# EAGLE board EEZ Arduino shield+BP r1B13 (EAGLE 6.1), part 1 of 2
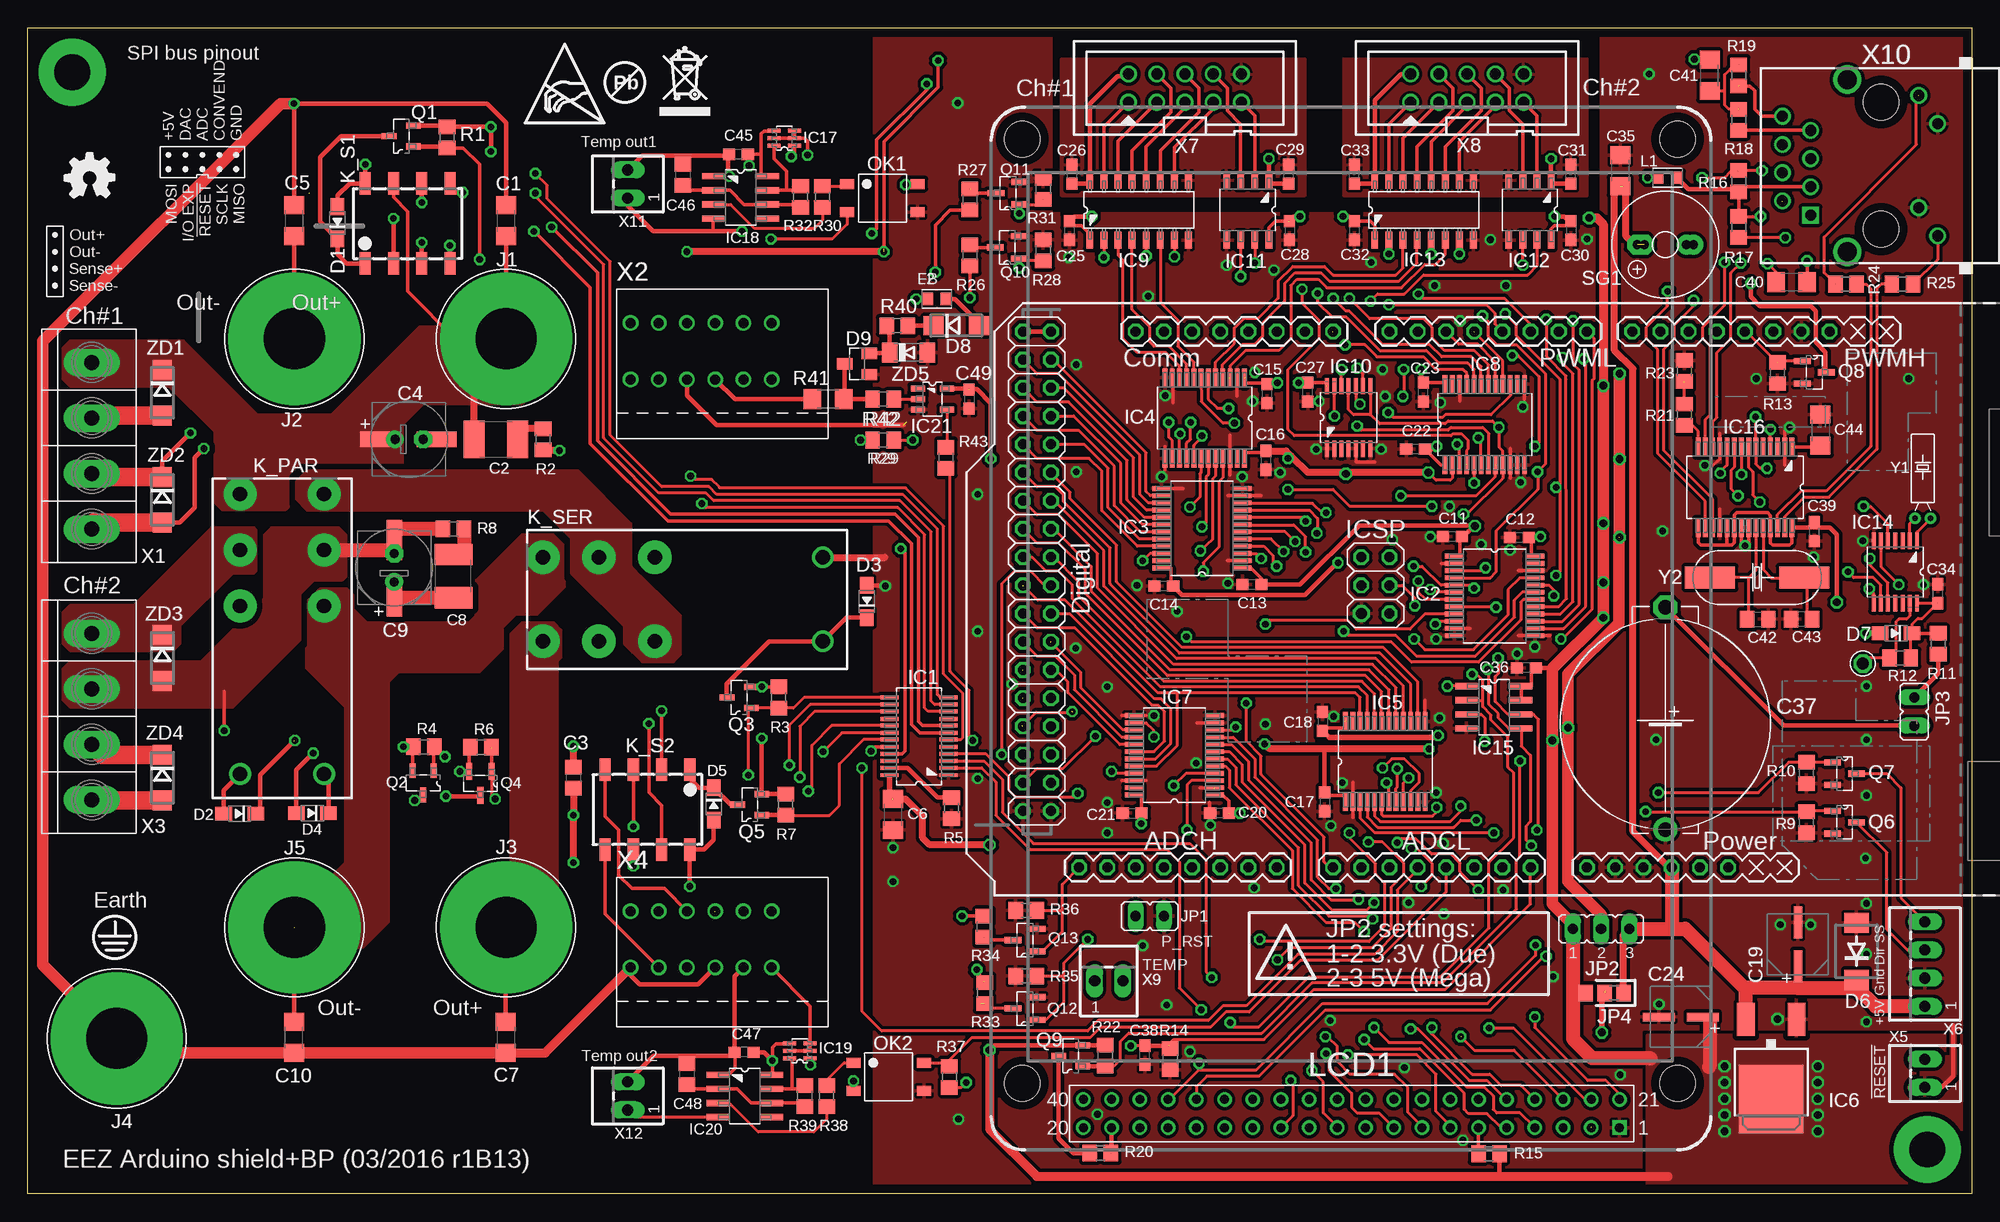
[diagram p5: board, top side]
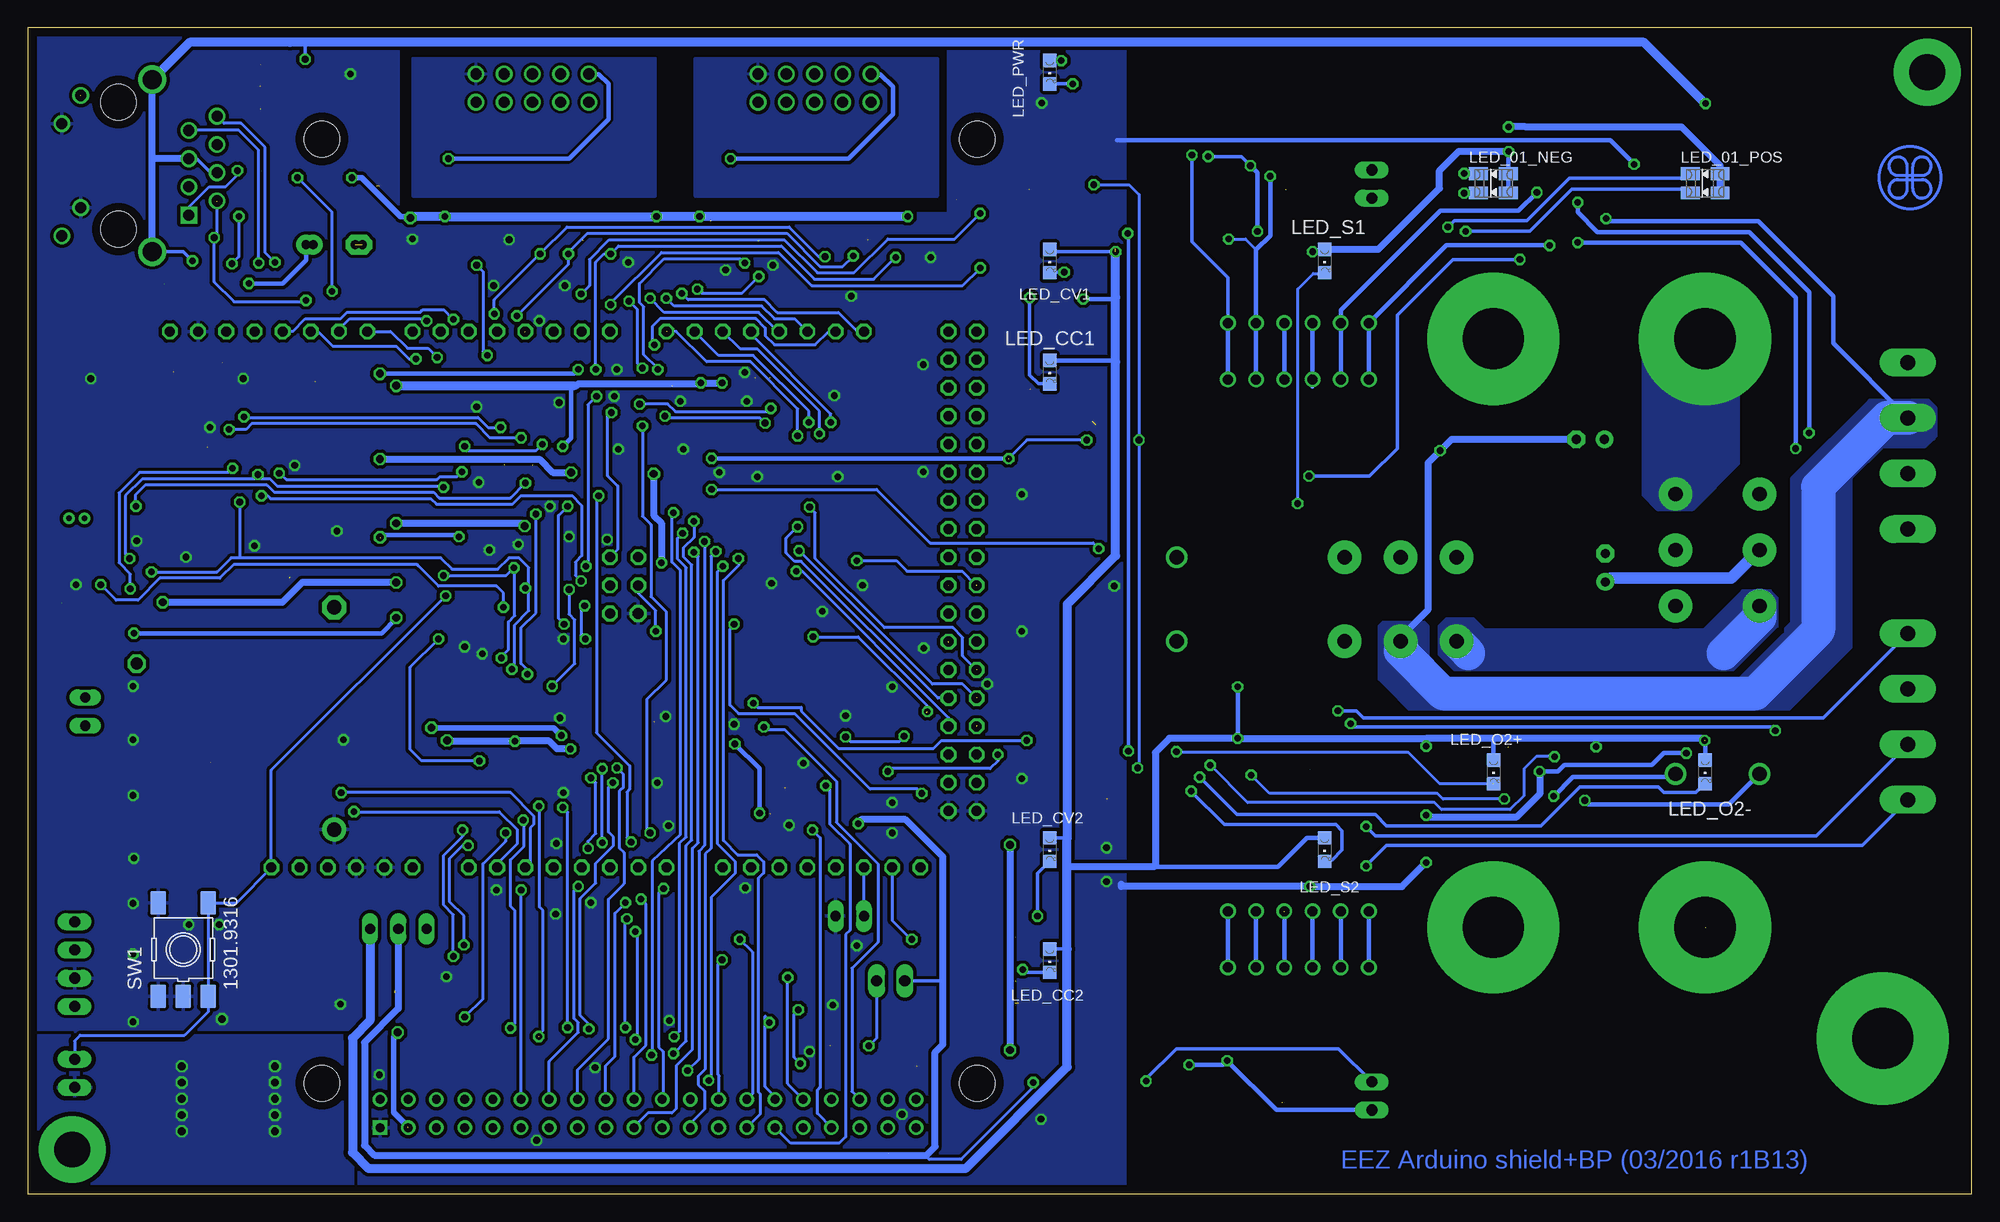
[diagram p6: board, bottom side, seen from below]

Size 175 x 105 mm. Coordinates in mm from the lower left corner, seen from the top.
Outline: 0,0 0,105 175,105 175,0 0,0
Copper layers (1+5*16): Top 0.035mm / dielectric 0.75mm / Route5 0.035mm / dielectric 0.75mm / Bottom 0.035mm
Design rules: minimum track width 10mil, minimum drill 0.5mm, track to track 8mil, track to pad 8mil, pad to pad 8mil, via to via 8mil, smd to smd 8mil, copper to edge 30mil, drill to drill 8mil, minimum pad ring 10mil, minimum via ring 8mil, stop-mask expansion 0mil, vias tented up to drill 25mil, thermal gap 10mil
Net classes: 0 default: width 0.254 mm, drill 0.584 mm, clearance 0.254 mm; 1 power: width 0.254 mm, drill 0.584 mm, clearance 0.203 mm; 2 gnd: width 0.254 mm, drill 0.584 mm, clearance 0.203 mm; 3 isolators: width 0.254 mm, drill 0.584 mm, clearance 0.254 mm

## Footprints (pad centres in the part's own frame; a part is rotated, then mirrored left to right if it is on the bottom)
C1206 = smd 1.6 x 1.8: 1 -1.4,0; 2 1.4,0
C1812 = smd 1.9 x 3.4: 1 -1.95,0; 2 1.95,0
C0805 = smd 1.3 x 1.5: 1 -0.95,0; 2 0.95,0
CAPAE660X610N_COMBO2 = smd 3.6 x 1.4: 1 -2.6,0; 2 2.5,0 | drill 0.813 pad 1.6: 1.1 -1.27,0 | drill 0.813 pad 1.6 octagon: 2.1 1.27,0
C0603 = smd 1.1 x 1: 1 -0.85,0; 2 0.85,0
PANASONIC_C = smd 2.87 x 0.762: 1 -1.981,0; 2 1.981,0
SG-R20MM = drill 1.3 pad 2.184 octagon: 1 10.389,0 | drill 1.3 pad 2.184: 2 -9.601,0
SOD323-W = smd 1.5 x 1.2: A 1.45,0; C -1.45,0
DO214AA = smd 1.8 x 2.2: A 2.55,0; C -2.55,0
DO214AC = smd 1.8 x 1.7: A 2.05,0; C -2.05,0
SOT23 = smd 1 x 1.4: 1 -0.95,-1.1; 2 0.95,-1.1; 3 0,1.1
SOP63P600X175-24N = smd 1.6 x 0.356: 1 -2.667,3.505; 2 -2.667,2.845; 3 -2.667,2.235; 4 -2.667,1.575; 5 -2.667,0.965; 6 -2.667,0.305; 7 -2.667,-0.305; 8 -2.667,-0.965; 9 -2.667,-1.575; 10 -2.667,-2.235; 11 -2.667,-2.845; 12 -2.667,-3.505; 13 2.667,-3.505; 14 2.667,-2.845; 15 2.667,-2.235; 16 2.667,-1.575; 17 2.667,-0.965; 18 2.667,-0.305; 19 2.667,0.305; 20 2.667,0.965; 21 2.667,1.575; 22 2.667,2.235; 23 2.667,2.845; 24 2.667,3.505
SOP65P780X200-24N = smd 1.651 x 0.432: 1 -3.632,3.581; 2 -3.632,2.921; 3 -3.632,2.286; 4 -3.632,1.626; 5 -3.632,0.965; 6 -3.632,0.33; 7 -3.632,-0.33; 8 -3.632,-0.965; 9 -3.632,-1.626; 10 -3.632,-2.286; 11 -3.632,-2.921; 12 -3.632,-3.581; 13 3.632,-3.581; 14 3.632,-2.921; 15 3.632,-2.286; 16 3.632,-1.626; 17 3.632,-0.965; 18 3.632,-0.33; 19 3.632,0.33; 20 3.632,0.965; 21 3.632,1.626; 22 3.632,2.286; 23 3.632,2.921; 24 3.632,3.581
DPACK = smd 1.6 x 3: 1 -2.28,-4.8; 3 2.28,-4.8 | smd 5.8 x 6.2: 4 0,2.38
SOIC-16 = smd 1.549 x 0.61: 1 -2.692,4.445; 2 -2.692,3.175; 3 -2.692,1.905; 4 -2.692,0.635; 5 -2.692,-0.635; 6 -2.692,-1.905; 7 -2.692,-3.175; 8 -2.692,-4.445; 9 2.692,-4.445; 10 2.692,-3.175; 11 2.692,-1.905; 12 2.692,-0.635; 13 2.692,0.635; 14 2.692,1.905; 15 2.692,3.175; 16 2.692,4.445
SOP65P640X120-14N = smd 1.473 x 0.356: 1 -2.819,1.956; 2 -2.819,1.295; 3 -2.819,0.66; 4 -2.819,0; 5 -2.819,-0.66; 6 -2.819,-1.295; 7 -2.819,-1.956; 8 2.819,-1.956; 9 2.819,-1.295; 10 2.819,-0.66; 11 2.819,0; 12 2.819,0.66; 13 2.819,1.295; 14 2.819,1.956
SOIC127P600X173-8N = smd 1.55 x 0.6: 1 -2.7,1.9; 2 -2.7,0.63; 3 -2.7,-0.64; 4 -2.7,-1.91; 5 2.7,-1.91; 6 2.7,-0.64; 7 2.7,0.63; 8 2.7,1.9
SOIC127P600X175-8N = smd 1.981 x 0.559: 1 -2.464,1.905; 2 -2.464,0.635; 3 -2.464,-0.635; 4 -2.464,-1.905; 5 2.464,-1.905; 6 2.464,-0.635; 7 2.464,0.635; 8 2.464,1.905
SOP65P780X200-28N = smd 1.651 x 0.432: 1 -3.632,4.216; 2 -3.632,3.581; 3 -3.632,2.921; 4 -3.632,2.286; 5 -3.632,1.626; 6 -3.632,0.965; 7 -3.632,0.33; 8 -3.632,-0.33; 9 -3.632,-0.965; 10 -3.632,-1.626; 11 -3.632,-2.286; 12 -3.632,-2.921; 13 -3.632,-3.581; 14 -3.632,-4.216; 15 3.632,-4.216; 16 3.632,-3.581; 17 3.632,-2.921; 18 3.632,-2.286; 19 3.632,-1.626; 20 3.632,-0.965; 21 3.632,-0.33; 22 3.632,0.33; 23 3.632,0.965; 24 3.632,1.626; 25 3.632,2.286; 26 3.632,2.921; 27 3.632,3.581; 28 3.632,4.216
SOT65P210X110-6N = smd 1.168 x 0.356: 1 -0.94,0.66; 2 -0.94,0; 3 -0.94,-0.66; 4 0.94,-0.66; 5 0.94,0; 6 0.94,0.66
SOT95P280X145-5N = smd 1.27 x 0.559: 1 -1.295,0.94; 2 -1.295,0; 3 -1.295,-0.94; 4 1.295,-0.94; 5 1.295,0.94
BP_5_12 = drill 5.5 pad 11.9: P$1 0,0
JP1 = drill 0.914 long: 1 0,-1.27; 2 0,1.27
JUMPER_3-PIN = drill 0.914 long: 1 -2.54,0; 2 0,0; 3 2.54,0
A0R-JMP = smd 1.5 x 1.3: 1 0,1.7; 2 0,0; 3 0,-1.7
RT-C/016A5_ROUND = drill 1.3 pad 3: 11A 8.83,3.78; 11B 8.83,-3.78; 12A 3.79,3.78; 12B 3.79,-3.78; 14A 13.87,3.78; 14B 13.87,-3.78 | drill 1.3: A1 -11.33,-3.78; A2 -11.33,3.78
G6K-2F = smd 1 x 2: 1 -3.81,-3.6; 2 -1.27,-3.6; 3 1.27,-3.6; 4 3.81,-3.6; 5 3.81,3.6; 6 1.27,3.6; 7 -1.27,3.6; 8 -3.81,3.6
BEAD0603 = smd 1 x 1.1: P$1 -0.85,0; P$2 0.85,0
LCD_TFT_320QVT_MIRROR = drill 0.8 square: 1 48.26,0 | drill 0.8: 2 45.72,0; 3 43.18,0; 4 40.64,0; 5 38.1,0; 6 35.56,0; 7 33.02,0; 8 30.48,0; 9 27.94,0; 10 25.4,0; 11 22.86,0; 12 20.32,0; 13 17.78,0; 14 15.24,0; 15 12.7,0; 16 10.16,0; 17 7.62,0; 18 5.08,0; 19 2.54,0; 20 0,0; 21 48.26,2.54; 22 45.72,2.54; 23 43.18,2.54; 24 40.64,2.54; 25 38.1,2.54; 26 35.56,2.54; 27 33.02,2.54; 28 30.48,2.54; 29 27.94,2.54; 30 25.4,2.54; 31 22.86,2.54; 32 20.32,2.54; 33 17.78,2.54; 34 15.24,2.54; 35 12.7,2.54; 36 10.16,2.54; 37 7.62,2.54; 38 5.08,2.54; 39 2.54,2.54; 40 0,2.54 | hole 3.2: -5.5,4; 53.5,4; -5.5,89; 53.5,89
LED_KPB-3025 = smd 1.7 x 1.15: 1 1.35,0.875; 2 -1.35,0.875; 3 1.35,-0.875; 4 -1.35,-0.875
CHIPLED_0805 = smd 1.2 x 1.2: A 0,-1.05; C 0,1.05
ARDUINO+ICSP_MIRROR = drill 0.9 octagon: 0 63.5,2.54; 1 60.96,2.54; 2 58.42,2.54; 3 55.88,2.54; 3.3V 35.56,50.8; 4 53.34,2.54; 5 50.8,2.54; 5V 38.1,50.8; 5V(1) 93.98,2.54; 5V(2) 96.52,2.54; 6 48.26,2.54; 7 45.72,2.54; 8 41.656,2.54; 9 39.116,2.54; 10 36.576,2.54; 11 34.036,2.54; 12 31.496,2.54; 13 28.956,2.54; 14 68.58,2.54; 15 71.12,2.54; 16 73.66,2.54; 17 76.2,2.54; 18 78.74,2.54; 19 81.28,2.54; 20 83.82,2.54; 21 86.36,2.54; 22 93.98,5.08; 23 96.52,5.08; 24 93.98,7.62; 25 96.52,7.62; 26 93.98,10.16; 27 96.52,10.16; 28 93.98,12.7; 29 96.52,12.7; 30 93.98,15.24; 31 96.52,15.24; 32 93.98,17.78; 33 96.52,17.78; 34 93.98,20.32; 35 96.52,20.32; 36 93.98,22.86; 37 96.52,22.86; 38 93.98,25.4; 39 96.52,25.4; 40 93.98,27.94; 41 96.52,27.94; 42 93.98,30.48; 43 96.52,30.48; 44 93.98,33.02; 45 96.52,33.02; 46 93.98,35.56; 47 96.52,35.56; 48 93.98,38.1; 49 96.52,38.1; 50 93.98,40.64; 51 96.52,40.64; 52 93.98,43.18; 53 96.52,43.18; A0 50.8,50.8; A1 53.34,50.8; A2 55.88,50.8; A3 58.42,50.8; A4 60.96,50.8; A5 63.5,50.8; A6 66.04,50.8; A7 68.58,50.8; A8 73.66,50.8; A9 76.2,50.8; A10 78.74,50.8; A11 81.28,50.8; A12 83.82,50.8; A13 86.36,50.8; A14 88.9,50.8; A15 91.44,50.8; AREF 23.876,2.54; GND 26.416,2.54; GND1 40.64,50.8; GND2 43.18,50.8; GND3 93.98,45.72; GND4 96.52,45.72; ICSP_+5V 66.04,22.86; ICSP_MISO 63.5,22.86; ICSP_MOSI 66.04,25.4; ICSP_RESET 63.5,27.94; ICSP_SCK 63.5,25.4; RESET 33.02,50.8; VIN 45.72,50.8 | drill 1.016 octagon: ICSP_GND 66.04,27.94
HCPL-181 = smd 0.889 x 1.27: 1 -1.27,-3.175; 2 1.27,-3.175; 3 1.27,3.175; 4 -1.27,3.175
SOT95P237X112-3N = smd 1.321 x 0.559: 1 -1.092,0.94; 2 -1.092,-0.94; 3 1.092,0
SOT103P240X110-3N = smd 1.524 x 0.559: 1 -1.079,1.016; 2 -1.079,-1.016; 3 1.079,0
R0805 = smd 1.3 x 1.5: 1 -0.95,0; 2 0.95,0
R1206 = smd 1.6 x 1.803: 1 -1.422,0; 2 1.422,0
BUZZER = drill 0.8 pad 1.778 octagon: + 1.905,0; +B 2.54,0 | drill 0.8 pad 1.778: - -1.905,0; -B -2.54,0
TACTM-6XN = smd 2.1 x 1.4: 1 -4.2,2.25; 2 4.2,2.25; 3 -4.2,-2.25; 4 4.2,-2.25; 5 -4.2,0
PCB_SHIELD_TAB = drill 1.1 octagon: 1 0,0
TBLOCK5.0_4 = drill 1.35 pad 2.54 long: P$1 0,0; P$2 0,-5; P$3 0,-10; P$4 0,-15
MC000005_MIRROR = drill 0.9: 1 0,0; 1.1 0,-5.08; 2 -2.54,0; 2.1 -2.54,-5.08; 3 -5.08,0; 3.1 -5.08,-5.08; 4 -7.62,0; 4.1 -7.62,-5.08; 5 -10.16,0; 5.1 -10.16,-5.08; 6 -12.7,0; 6.1 -12.7,-5.08
22-23-2021 = drill 1 long: 1 -1.27,0; 2 1.27,0
22-23-2041 = drill 1 long: 1 -3.81,0; 2 -1.27,0; 3 1.27,0; 4 3.81,0
IDC-10PIN = drill 1 pad 1.422: 1 -5.08,-1.27; 2 -5.08,1.27; 3 -2.54,-1.27; 4 -2.54,1.27; 5 0,-1.27; 6 0,1.27; 7 2.54,-1.27; 8 2.54,1.27; 9 5.08,-1.27; 10 5.08,1.27
RJ45-TRAFO-LED = drill 1 square: 1 -4.445,6.35 | drill 1: 2 -3.175,8.89; 3 -1.905,6.35; 4 -0.635,8.89; 5 0.635,6.35; 6 1.905,8.89; 7 3.175,6.35; 8 4.445,8.89; 9 -6.325,-5.08; 10 -3.785,-3.38; 11 3.785,-5.08; 12 6.325,-3.38 | drill 1.7: SH1 -7.75,3.05; SH2 7.75,3.05 | hole 3.2: -5.715,0; 5.715,0
R26_XTAL = drill 0.5: 1 -0.7,0; 2 0.7,0
HC-49/4H = smd 4.5 x 2: 1 -4.25,0; 2 4.25,0
MINIMELF = smd 1.4 x 1.8: A 1.7,0; C -1.7,0

## Placement (x,y rotation side)
C1  10n  [C1206]  43.08,87.63 90 top
C2  470n/100V  [C1812]  42.14,67.94 0 top
C3  1u  [C0805]  49.12,37.47 270 top
C4  22u/63V  [CAPAE660X610N_COMBO2]  34.33,67.94 0 top
C5  10n  [C1206]  23.97,87.63 270 top
C6  10u  [C1206]  77.89,34.16 270 top
C7  10n  [C1206]  43.03,14.1 270 top
C8  470n/100V  [C1812]  38.33,55.63 90 top
C9  22u/63V  [CAPAE660X610N_COMBO2]  32.99,56.39 90 top
C10  10n  [C1206]  23.97,14.1 90 top
C11  100n  [C0603]  128.24,59.18 180 top
C12  100n  [C0603]  134.27,59.12 0 top
C13  100n  [C0603]  110.21,54.86 180 top
C14  100n  [C0603]  102.27,54.74 0 top
C15  100n  [C0603]  111.54,72.06 270 top
C16  100n  [C0603]  111.48,66.05 90 top
C17  100n  [C0603]  116.75,35.31 270 top
C18  100n  [C0603]  116.56,42.55 270 top
C19  47u  [PANASONIC_C]  159.36,22.48 90 top
C20  100n  [C0603]  107.29,34.29 180 top
C21  100n  [C0603]  99.41,34.29 0 top
C22  100n  [C0603]  124.94,67.06 180 top
C23  100n  [C0603]  125.64,72.2 90 top
C24  10u  [PANASONIC_C]  148.82,15.94 180 top
C25  100n  [C0603]  93.76,86.74 270 top
C26  100n  [C0603]  94.02,91.82 90 top
C27  100n  [C0603]  115.22,72.2 90 top
C28  100n  [C0603]  113.57,86.74 270 top
C29  100n  [C0603]  113.51,91.82 90 top
C30  100n  [C0603]  138.91,86.74 270 top
C31  100n  [C0603]  138.91,91.82 90 top
C32  100n  [C0603]  119.41,86.74 270 top
C33  100n  [C0603]  119.41,91.82 90 top
C34  100n  [C0603]  171.93,54.04 270 top
C35  10u  [C1206]  143.35,92.14 270 top
C36  100n  [C0603]  134.91,47.37 180 top
C37  EECS5R5H105  [SG-R20MM]  147.42,42.42 90 top
C38  100n  [C0603]  100.56,12.51 90 top
C39  100n  [C0603]  160.82,59.63 270 top
C40  10n  [C1206]  158.78,82.11 0 top
C41  10n  [C1206]  151.42,100.71 90 top
C42  18p  [C0805]  155.74,51.75 0 top
C43  18p  [C0805]  159.67,51.75 180 top
C44  10u  [C1206]  161.39,68.77 270 top
C45  100n  [C0603]  63.98,93.6 180 top
C46  47n  [C0805]  58.96,91.76 270 top
C47  100n  [C0603]  64.49,12.76 180 top
C48  47n  [C0805]  59.34,10.79 270 top
C49  100n  [C0603]  84.74,71.56 270 top
D1  BAS316  [SOD323-W]  27.88,87.44 90 top
D2  BAS316  [SOD323-W]  19.09,34.23 180 top
D3  BAS316  [SOD323-W]  75.54,53.34 90 top
D4  BAS316  [SOD323-W]  25.63,34.29 180 top
D5  BAS316  [SOD323-W]  61.76,35.12 270 top
D6  SMBJ5.0A-TR  [DO214AA]  164.63,21.84 90 top
D7  BAS316  [SOD323-W]  168.18,50.48 180 top
D8  SKL16  [DO214AC]  83.6,78.17 0 top
D9  BAT54S  [SOT23]  74.65,74.74 90 top
EEZ_SIGNATURE  SIGNATURESMALL  [SIGNATURE_5MM]  5.56,91.51 180 top
IC1  TLC5925  [SOP63P600X175-24N]  80.23,41.21 180 top
IC2  SN74LVCC3245ADBRSSOP  [SOP65P780X200-24N]  132.05,53.85 0 top
IC3  SN74LVCC3245ADBRSSOP  [SOP65P780X200-24N]  105.7,59.94 180 top
IC4  SN74LVCC3245ADBRSSOP  [SOP65P780X200-24N]  105.95,69.85 270 top
IC5  SN74LVCC3245ADBRSSOP  [SOP65P780X200-24N]  122.21,38.93 90 top
IC6  LD1117ADT33TR  [DPACK]  156.94,10.92 180 top
IC7  SN74LVCC3245ADBRSSOP  [SOP65P780X200-24N]  103.22,39.5 180 top
IC8  SN74LVCC3245ADBRSSOP  [SOP65P780X200-24N]  131.16,69.28 90 top
IC9  Si8660EC-B-IS1  [SOIC-16]  100.05,88.58 90 top
IC10  SN74LV125APW  [SOP65P640X120-14N]  118.91,69.91 90 top
IC11  SI8620EC-B-IS  [SOIC127P600X173-8N]  109.83,88.58 270 top
IC12  SI8620EC-B-IS  [SOIC127P600X173-8N]  135.23,88.58 270 top
IC13  Si8660EC-B-IS1  [SOIC-16]  125.7,88.58 90 top
IC14  PCA21125  [SOP65P640X120-14N]  168.12,56.01 270 top
IC15  AT25256B  [SOIC127P600X175-8N]  131.99,43.81 0 top
IC16  ENC28J60-I/SS  [SOP65P780X200-28N]  154.59,63.63 270 top
IC17  BC857BS  [SOT65P210X110-6N]  68.11,95.06 180 top
IC18  NE555D  [SOIC127P600X175-8N]  64.17,89.73 0 top
IC19  BC857BS  [SOT65P210X110-6N]  69.5,12.89 180 top
IC20  NE555D  [SOIC127P600X175-8N]  64.55,8.83 0 top
IC21  SN74LV1T34  [SOT95P280X145-5N]  81.44,71.56 0 top
J1  BS-244DSM-R  [BP_5_12]  43.05,77 0 top
J2  BS-244DSM-B  [BP_5_12]  24,77 0 top
J3  BS-244DSM-R  [BP_5_12]  43.05,24 0 top
J4  BS-244DSM-G  [BP_5_12]  8,14 0 top
J5  BS-244DSM-B  [BP_5_12]  24,24 0 top
JP1  826926-2  [JP1]  101,25.02 270 top
JP2  826926-3  [JUMPER_3-PIN]  141.64,23.88 0 top
JP3  826926-2  [JP1]  169.83,43.43 180 top
JP4  0R-JUMPA  [A0R-JMP]  141.96,18.1 270 top
K_PAR  RT424005  [RT-C/016A5_ROUND]  22.9,49.15 90 top
K_S1  G6K-2F-5DC  [G6K-2F]  34.2,87.38 0 top
K_S2  G6K-2F-5DC  [G6K-2F]  55.79,34.61 180 top
K_SER  RT424005  [RT-C/016A5_ROUND]  60.23,53.53 180 top
L1  60R@100MHz  [BEAD0603]  147.61,91.5 180 top
L2  60R@100MHz  [BEAD0603]  81.82,80.58 0 top
LCD1  TFT_320QVT  [LCD_TFT_320QVT_MIRROR]  95.03,5.97 0 top
LED_01_NEG  HSMF-C155  [LED_KPB-3025]  43.05,91 0 bottom
LED_01_POS  HSMF-C155  [LED_KPB-3025]  24,91 0 bottom
LED_CC1  HSMH-C170  [CHIPLED_0805]  83,74 180 bottom
LED_CC2  HSMH-C170  [CHIPLED_0805]  83,21 180 bottom
LED_CV1  L-934YD  [CHIPLED_0805]  83,84 180 bottom
LED_CV2  L-934YD  [CHIPLED_0805]  83,31 180 bottom
LED_O2+  HSMG-C170  [CHIPLED_0805]  43.05,38 180 bottom
LED_O2-  HSMG-C170  [CHIPLED_0805]  24,38 180 bottom
LED_PWR  HSMR-C170  [CHIPLED_0805]  83,101 180 bottom
LED_S1  HSMY-C170  [CHIPLED_0805]  58.25,84 180 bottom
LED_S2  HSMY-C170  [CHIPLED_0805]  58.25,31 180 bottom
MCU  [ARDUINO+ICSP_MIRROR]  186.09,80.2 180 top
OK1  HCPL-181  [HCPL-181]  76.93,89.66 270 top
OK2  HCPL-181  [HCPL-181]  77.5,10.54 270 top
Q1  IRLML2246TRPBF  [SOT95P237X112-3N]  33.63,95.25 180 top
Q2  IRLML2246TRPBF  [SOT95P237X112-3N]  35.59,37.02 270 top
Q3  IRLML2246TRPBF  [SOT95P237X112-3N]  64.04,44.7 180 top
Q4  2N7002  [SOT103P240X110-3N]  40.74,36.96 270 top
Q5  IRLML2246TRPBF  [SOT95P237X112-3N]  65,35.05 180 top
Q6  2N7002  [SOT103P240X110-3N]  163.55,33.46 0 top
Q7  2N7002  [SOT103P240X110-3N]  163.55,37.85 0 top
Q8  2N7002  [SOT103P240X110-3N]  160.82,73.98 0 top
Q9  IRLML2246TRPBF  [SOT95P237X112-3N]  93.89,12.45 180 top
Q10  2N7002  [SOT103P240X110-3N]  88.17,85.22 180 top
Q11  2N7002  [SOT103P240X110-3N]  88.24,90.11 180 top
Q12  2N7002  [SOT103P240X110-3N]  89.76,16.7 180 top
Q13  2N7002  [SOT103P240X110-3N]  89.76,22.86 180 top
R1  4K7  [R0805]  37.75,95.12 90 top
R2  1R  [R0805]  46.39,67.94 90 top
R3  4K7  [R0805]  67.6,44.7 90 top
R4  100K  [R0805]  35.66,40.26 180 top
R5  1K5  [R0805]  83.16,34.74 90 top
R6  100K  [R0805]  40.8,40.22 0 top
R7  4K7  [R0805]  68.23,35.05 90 top
R8  1R  [R0805]  38.33,59.88 0 top
R9  100K  [R0805]  160.12,33.46 270 top
R10  100K  [R0805]  160.12,37.91 270 top
R11  560R  [R0805]  171.99,49.53 90 top
R12  10K  [R0805]  168.56,48.26 180 top
R13  100K  [R0805]  157.51,73.91 90 top
R14  4K7  [R0805]  102.84,12.13 270 top
R15  10K  [R0805]  131.54,3.62 0 top
R16  49R9  [R0805]  154.02,91.19 90 top
R17  49R9  [R0805]  154.02,87.06 90 top
R18  49R9  [R0805]  154.02,96.71 270 top
R19  49R9  [R0805]  154.02,100.71 90 top
R20  10R  [R0805]  96.56,3.68 0 top
R21  2K2 1%  [R0805]  149.13,70.17 90 top
R22  100K  [R0805]  97,12.45 90 top
R23  120R 1%  [R0805]  149.13,74.1 90 top
R24  200R  [R0805]  163.67,81.92 180 top
R25  200R  [R0805]  168.75,81.92 0 top
R26  240R  [R0805]  84.81,84.52 90 top
R27  240R  [R0805]  84.81,89.53 270 top
R28  100K  [R0805]  91.41,84.96 90 top
R29  1K5  [R0805]  77,67.88 180 top
R30  180R  [R0805]  71.54,89.79 90 top
R31  100K  [R0805]  91.41,90.49 90 top
R32  1K5  [R0805]  69.57,89.79 270 top
R33  240R  [R0805]  86.14,18.1 270 top
R34  240R  [R0805]  86.08,24.07 90 top
R35  100K  [R0805]  89.89,19.62 180 top
R36  100K  [R0805]  89.89,25.53 180 top
R37  1K5  [R0805]  82.97,10.54 90 top
R38  180R  [R0805]  71.92,8.83 90 top
R39  1K5  [R0805]  69.95,8.83 270 top
R40  100R  [R0805]  78.27,78.17 0 top
R41  10K  [R1206]  72.04,71.56 0 top
R42  1K  [R0805]  77,71.56 180 top
R43  1K  [R0805]  82.65,66.29 90 top
SG1  LD-BZEN-0903  [BUZZER]  147.42,85.47 180 top
SW1  1301.9316  [TACTM-6XN]  161,22 90 bottom
TP1  [PCB_SHIELD_TAB]  165.2,47.75 0 top
U$2  [RECYCLE_BIN1/8]  56.87,97.09 0 top
U$3  [PB_SMALL]  53.76,100.08 0 top
U$4  [ESD_SYMBOL]  44.77,96.44 0 top
X1  282836-4  [TBLOCK5.0_4]  5.75,74.87 0 top
X2  MC000005  [MC000005_MIRROR]  66.96,78.42 0 top
X3  282836-4  [TBLOCK5.0_4]  5.75,50.48 0 top
X4  MC000005  [MC000005_MIRROR]  66.96,25.46 0 top
X5  22-23-2021  [22-23-2021]  170.79,10.86 90 top
X6  22-23-2041  [22-23-2041]  170.78,20.7 90 top
X7  09185106324  [IDC-10PIN]  104.18,99.57 0 top
X8  09185106324  [IDC-10PIN]  129.57,99.57 0 top
X9  22-23-2021  [22-23-2021]  97.32,19.18 0 top
X10  LMJTAB881243M-L  [RJ45-TRAFO-LED]  166.85,92.58 90 top
X11  22-23-2021  [22-23-2021]  54.01,90.93 90 top
X12  22-23-2021  [22-23-2021]  54.01,8.83 90 top
Y1  32,768kHz  [R26_XTAL]  170.6,60.83 0 top
Y2  25MHz  [HC-49/4H]  155.67,55.5 180 top
ZD1  P4SMAJ60A  [DO214AC]  12.1,72.14 270 top
ZD2  P4SMAJ60A  [DO214AC]  12.1,62.48 270 top
ZD3  P4SMAJ60A  [DO214AC]  12.1,48.26 270 top
ZD4  P4SMAJ60A  [DO214AC]  12.1,37.47 270 top
ZD5  4V3  [MINIMELF]  79.28,75.76 0 top

## Tracks (layer width: path | path; a pad name or v marks a point on that pad's centre or on a via)
3V3BP_SELECT  (via drill 0.6)
  Top 0.254: v94.52,36.07 94.21,35.75 88.94,35.75 88.3,36.39 88.3,37.59 86.26,39.64 IC1.4 | IC2.9 125.79,52.22 124.43,50.86 119.61,50.86 118.84,51.63 111.73,51.63 v111.41,51.31
  Bottom 0.254: v94.52,36.07 94.9,36.45 99.16,36.45 105.95,43.24 111.03,43.24 111.79,44.01 111.79,50.86 v111.41,51.31
3V3LCD_CS  (via drill 0.6)
  Top 0.254: IC7.4 104.26,37.87 v103.16,36.77
  Bottom 0.254: LCD1.15 106.32,4.57 101.95,4.57 101.38,5.14 101.38,23.37 101,23.75 101,31.5 102.78,33.27 102.78,36.39 v103.16,36.77
3V3LCD_DB0  (via drill 0.6)
  Top 0.254: LCD1.21 143.29,9.02 142.08,10.22 140.43,10.22 135.67,14.99 v135.67,15.94 | v131.99,32.51 121.26,32.51 119.92,33.85 IC5.3
  Bottom 0.254: v135.67,15.94 134.02,17.59 134.02,29.72 131.99,31.75 v131.99,32.51
3V3LCD_DB1  (via drill 0.6)
  Top 0.254: v131.54,14.94 133.75,14.94 140.18,8.51 140.73,8.51 LCD1.22 | IC5.4 120.58,33.95 121.51,33.02 128.37,33.02 129,33.66 v130.4,33.66
  Bottom 0.254: v131.54,14.94 131.16,15.32 131.16,25.53 131.54,25.91 131.54,30.1 130.34,31.3 130.34,33.59 v130.4,33.66
3V3LCD_DB2  (via drill 0.6)  (1 unrouted)
  Top 0.254: LCD1.23 133.78,12.95 130.21,12.95 129,14.16 | IC5.5 121.24,34.05 121.76,33.53 128.05,33.53 129,34.48 v129,34.92
  Bottom 0.254: v129,14.18 129,14.35 128.62,14.73 128.62,25.53 128.94,25.84 128.94,34.86 v129,34.92
3V3LCD_DB3  (via drill 0.6)
  Top 0.254: LCD1.24 135.65,8.53 134.4,9.78 132.62,9.78 131.61,10.79 130.02,10.79 126.4,14.41 v126.4,14.99 | IC5.6 121.89,35.28 121.89,34.16 122.02,34.04 126.46,34.04 126.84,34.42 v126.84,34.8
  Bottom 0.254: v126.4,14.99 126.4,34.35 v126.84,34.8
3V3LCD_DB4  (via drill 0.6)
  Top 0.254: 133.11,8.53 LCD1.25 133.05,8.53 131.35,10.22 129.77,10.22 125.13,14.86 v124.5,14.86 | IC5.7 122.54,36.82 v122.34,37.02
  Bottom 0.254: v122.34,37.02 122.72,36.64 122.72,32.58 122.27,32.13 122.27,31.37 123.86,29.78 123.86,28 125.26,26.61 125.26,16.07 124.5,15.3 v124.5,14.86
3V3LCD_DB5  (via drill 0.6)
  Top 0.254: v130.59,27.37 128.94,29.02 128.94,29.78 128.11,30.61 126.4,30.61 126.21,30.8 124.94,32 123.67,32 v123.29,31.62 | v123.29,38.29 123.29,36.64 123.17,36.52 IC5.8
  Bottom 0.254: LCD1.26 v130.59,27.37 | v123.29,31.62 v123.29,38.29
3V3LCD_DB6  (via drill 0.6)
  Top 0.254: v124.56,31.11 125.07,31.11 126.4,29.78 126.4,28.64 v125.45,27.69 | IC5.9 123.84,36.99 v124.3,37.47
  Bottom 0.254: v124.56,31.11 124.56,31.75 123.86,32.45 123.86,37.02 v124.3,37.47 | LCD1.27 128.05,11.94 125.45,14.54 125.45,15.43 125.83,15.81 125.83,27.3 v125.45,27.69
3V3LCD_DB7  (via drill 0.6)
  Top 0.254: IC5.10 124.5,36.32 125.26,37.08 125.26,37.85 123.92,39.18 122.78,39.18 v121.96,38.35
  Bottom 0.254: LCD1.28 125.51,11.18 122.72,13.97 122.72,26.54 121.32,27.94 121.32,30.73 121.7,31.11 121.7,36.32 121.38,36.64 121.38,37.78 v121.96,38.35
3V3LCD_DB8  (via drill 0.6)
  Top 0.254: LCD1.7 128.05,6.16 126.78,7.43 126.78,10.79 125.07,12.51 v118.84,12.51 | v116.88,61.34 116.49,61.34 115.66,62.18 109.71,62.18 IC3.10
  Bottom 0.254: v118.84,12.51 118.78,12.57 118.78,29.97 116.24,32.38 116.24,56.13 117,56.9 117,61.21 v116.88,61.34
3V3LCD_DB9  (via drill 0.6)
  Top 0.254: LCD1.8 125.51,6.1 124.24,7.37 124.24,9.59 123.03,10.79 119.03,10.79 117.89,11.94 117.89,13.27 117,14.16 v116.81,14.16 | IC3.9 109.71,61.52 115.43,61.52 116.11,60.83 116.11,59.56 v116.05,59.5
  Bottom 0.254: v116.81,14.16 116.3,14.67 116.3,31.62 115.73,32.13 115.73,56.39 116.49,57.15 116.49,59.05 v116.05,59.5
3V3LCD_DB10  (via drill 0.6)
  Top 0.254: v115.03,60.58 114.7,60.91 IC3.8 | LCD1.9 121.64,7.3 119.67,7.3 119.16,7.81 119.16,9.08 117.19,11.05 117.19,12.32 v116.88,12.64
  Bottom 0.254: v115.03,60.58 115.03,59.12 115.99,58.17 115.99,57.4 115.22,56.64 115.22,31.88 115.73,31.37 115.73,13.78 v116.88,12.64
3V3LCD_DB11  (via drill 0.6)
  Top 0.254: IC3.7 109.71,60.25 113.97,60.25 115.03,59.18 v115.03,57.78
  Bottom 0.254: LCD1.10 120.43,6.03 119.16,7.3 117,7.3 116.62,7.68 116.62,11.56 115.16,13.02 115.16,31.11 114.65,31.62 114.65,57.4 v115.03,57.78
3V3LCD_DB12  (via drill 0.6)
  Top 0.254: LCD1.11 117.89,6.03 116.62,7.3 116.62,10.1 v115.6,11.11 | v114.08,58.74 113.18,59.64 109.71,59.64 IC3.6
  Bottom 0.254: v114.08,58.74 114.08,31.37 114.59,30.86 114.59,12.13 v115.6,11.11
3V3LCD_DB13  (via drill 0.6)
  Top 0.254: v113.06,57.85 111.94,58.98 IC3.5
  Bottom 0.254: LCD1.12 115.35,6.35 114.08,7.62 114.08,9.27 114.65,9.84 114.65,10.6 114.02,11.24 114.02,30.61 113.51,31.11 113.51,57.4 v113.06,57.85
3V3LCD_DB14  (via drill 0.6)
  Top 0.254: v112.43,56.52 112.11,56.83 112.11,57.47 111.26,58.32 IC3.4 | v113.7,10.22 113.89,10.03 113.89,7.05 LCD1.13
  Bottom 0.254: v112.43,56.52 112.94,56.01 112.94,31.56 111.29,29.91 111.29,28.89 113.45,26.73 113.45,10.48 v113.7,10.22
3V3LCD_DB15  (via drill 0.6)
  Top 0.254: IC3.3 110.59,57.66 v111.03,57.21
  Bottom 0.254: v111.03,57.21 111.03,56.58 112.37,55.24 112.37,31.81 111.1,30.54 109.38,30.54 108.75,29.91 108.75,28.89 109.19,28.45 109.19,9.14 109.06,9.02 109.06,7.19 LCD1.14
3V3LCD_RD
  Top 0.305: LCD1.6 130.59,3.81 R15.1
3V3LCD_RESET  (via drill 0.6)
  Top 0.254: IC7.3 104.75,37.21 104.37,36.83 v104.37,32.77
  Bottom 0.254: LCD1.17 103.92,7.26 103.92,9.34 103.67,9.59 103.67,32.07 v104.37,32.77
3V3LCD_RS  (via drill 0.6)
  Top 0.254: LCD1.4 135.65,5.99 134.34,7.3 132.24,7.3 131.92,7.62 131.92,8.83 131.1,9.65 129.51,9.65 125.51,13.65 122.53,13.65 v121.19,14.99 | v121.07,24.77 120.81,25.02 117.13,25.02 114.4,27.75 114.4,31.18 108.75,36.83 108.75,38.42 108,39.17 IC7.6
  Bottom 0.254: v121.07,24.77 121.26,24.57 121.26,15.05 v121.19,14.99
3V3LCD_WR  (via drill 0.6)
  Top 0.254: LCD1.5 132.61,5.99 131.35,7.24 129.7,7.24 129.32,7.62 129.32,9.08 125.32,13.08 121.13,13.08 v120.3,13.91 | v120.3,23.62 119.48,24.45 116.88,24.45 113.83,27.5 113.83,30.92 108.18,36.58 108.18,38.16 107.81,38.53 IC7.5
  Bottom 0.254: v120.3,13.91 120.11,14.1 120.11,23.43 v120.3,23.62
3V3LCDSD_CS  (via drill 0.6)
  Top 0.254: IC7.10 108.49,41.78 v108.75,42.04
  Bottom 0.254: LCD1.38 100.81,9.22 100.81,20.32 98.46,22.67 98.46,29.72 102.21,33.47 102.21,37.15 IC7.10 108.49,41.78 v108.75,42.04
3V3MISO  (via drill 0.6)
  Top 0.254: 155.55,67.25 v155.55,69.98 | IC16.6 155.55,67.25 | IC14.8 166.16,53.77 | 166.16,53.77 166.15,53.78 | 166.16,53.77 166.16,54.09 v165.77,54.48 | 155.55,67.25 155.55,65.72 155.93,65.34 v156.56,65.34 | 120.81,70.17 120.88,70.17 121.7,69.34 127.61,69.34 127.86,69.6 131.86,69.6 v132.43,69.03 132.43,67.25 132.79,66.89 IC8.9 132.79,64.43 129.57,61.21 v129.26,61.21 | 120.81,70.17 119.35,70.17 118.91,70.61 IC10.11 | IC10.8 120.86,70.22 120.81,70.17 | v108.24,15.43 108.49,15.05 110.84,15.05 115.35,19.56 127.16,19.56 131.54,23.94 131.54,29.84 133.77,32.07 133.77,37.91 133.26,38.42 133.26,41.15 131.73,42.67 131.73,43.12 130.97,43.88 130.97,44.39 | 130.97,44.39 130.97,46.23 130.4,46.8 v130.02,46.8 | IC15.2 130.91,44.45 130.97,44.39
  Bottom 0.254: v156.56,65.34 156.94,64.96 164.94,64.96 166.79,63.12 166.79,56.83 165.77,55.82 v165.77,54.48 | v155.55,69.98 155.48,69.91 134.46,69.91 133.58,69.03 v132.43,69.03 | LCD1.35 107.73,8.76 108.62,9.65 108.62,16 v108.24,15.43 | v129.26,61.21 129.26,52.32 130.59,50.99 130.59,47.75 130.02,47.18 v130.02,46.8
3V3MOSI  (via drill 0.6)
  Top 0.254: IC1.2 85.88,38.37 87.16,37.08 87.16,34.1 90.27,30.99 102.59,30.99 103.67,29.91 103.67,18.54 v105.64,16.57 | LCD1.37 102.8,8.53 105.44,11.18 | 105.44,11.18 110.59,11.18 116.56,17.14 131.42,17.14 135.73,21.46 v135.73,22.42 | v135.35,31.37 134.91,31.81 134.91,33.15 135.29,33.53 135.29,39.5 134.45,40.34 IC15.5 133.32,41.91 132.37,42.86 132.37,43.24 131.54,44.07 131.54,47.12 v131.42,47.24 | IC16.7 154.91,67.25 154.91,65.41 155.29,65.02 155.29,62.93 v155.93,62.29 | IC9.2 v96.87,84.33 | v122.53,84.64 IC13.2 | 105.44,11.18 v105.44,11.75 | IC14.9 166.82,54.83 166.15,55.5 164.37,55.5 v163.87,56.01 | v123.86,74.23 123.86,71.88 v123.8,71.82 | v124.75,56.52 125.51,56.52 127.21,54.81 IC2.5 129.94,54.81 v130.21,54.55
  Bottom 0.254: v135.35,31.37 135.86,31.37 137,30.23 137,26.29 135.73,25.02 v135.73,22.42 | v123.86,74.23 123.86,83.88 123.1,84.64 v122.53,84.64 121.83,85.34 107.16,85.34 104.18,82.36 98.84,82.36 v96.87,84.33 | v105.44,11.75 106.02,12.32 106.02,16.19 v105.64,16.57 | v163.87,56.01 157.96,56.01 156.69,57.28 155.93,57.28 | v155.93,62.29 155.93,57.28 | v131.42,47.24 131.35,47.24 131.16,47.43 131.16,51.24 129.89,52.51 129.89,54.55 | v123.8,71.82 124.56,71.06 124.56,56.71 v124.75,56.52 | 129.89,54.55 129.89,56.39 130.78,57.28 131.67,57.28 132.69,56.26 136.81,56.26 137.83,57.28 155.93,57.28 | v130.21,54.55 129.89,54.55
3V3RTC_SELECT  (via drill 0.6)
  Top 0.254: IC14.6 166.82,56.48 v168.44,54.86 | IC2.8 132.13,52.88 v132.18,52.83
  Bottom 0.254: v168.44,54.86 167.04,53.47 165.07,53.47 163.1,55.44 157.71,55.44 156.44,56.71 139.99,56.71 139.93,56.64 139.86,56.58 138.02,54.74 132.81,54.74 132.18,54.1 v132.18,52.83
3V3SCLK  (via drill 0.6)
  Top 0.254: IC1.3 86.09,38.98 87.73,37.34 87.73,34.35 90.52,31.56 104.62,31.56 106.08,30.1 106.08,20 v106.59,19.49 | 105.21,8.53 LCD1.36 105.19,9.65 106.14,10.6 110.84,10.6 116.81,16.57 131.67,16.57 136.5,21.4 v136.69,21.4 | v135.86,32.77 135.86,32.83 135.99,32.96 135.99,42.74 135.54,43.18 134.53,43.18 | 134.53,43.18 134.46,43.12 | 134.53,43.18 IC15.6 133.26,43.18 132.12,44.32 132.12,46.61 132.37,46.86 v132.37,48.26 | IC16.8 154.26,65.23 v154.28,64.77 | IC9.7 v103.22,84.39 | IC13.7 v128.88,84.64 | v133,79.25 134.02,78.23 134.02,77.28 137.96,73.34 137.96,63.63 | IC14.10 167.46,55.02 165.83,56.64 v165.83,57.21 | 137.96,63.63 137.96,56.01 v137.58,55.69 | v137.58,63.63 137.96,63.63 | IC2.3 130.97,56.13 v131.23,56.39
  Bottom 0.254: LCD1.36 106.59,9.92 v106.59,19.49 | v136.69,21.4 136.69,25.15 137.58,26.04 137.58,30.48 135.86,32.19 v135.86,32.77 | v133,79.25 133,80.52 v128.88,84.64 126.46,87.06 106.46,87.06 103.79,84.39 v103.22,84.39 | 154.28,64.39 153.2,64.39 152.56,63.75 137.96,63.75 v137.58,63.63 | v154.28,64.77 154.28,64.39 | 154.28,64.39 164.69,64.39 166.21,62.87 166.21,57.59 v165.83,57.21 | v132.37,48.26 132.37,48.39 131.73,49.02 131.73,51.5 131.16,52.07 131.16,56.33 v131.23,56.39 131.92,55.69 v137.58,55.69
3V3TOUCH_CS  (via drill 0.6)
  Top 0.254: v119.8,26.54 119.73,26.48 117.32,26.48 115.54,28.26 115.54,31.62 109.89,37.27 109.89,38.92 108.35,40.46 IC7.8
  Bottom 0.254: LCD1.30 120.43,12.32 119.35,13.4 119.35,26.1 v119.8,26.54
3V3TOUCH_DIN  (via drill 0.6)
  Top 0.254: v117.76,27.5 117.13,27.5 116.11,28.51 116.11,31.88 110.46,37.53 110.46,39.18 108.52,41.12 IC7.9
  Bottom 0.254: v117.76,27.5 117.83,27.5 118.21,27.11 118.21,13.21 117.83,12.83 117.83,8.59 LCD1.31
3V3TOUCH_DO  (via drill 0.6)  (1 unrouted)
  Top 0.254: v123.61,62.87 130.4,62.87 132.12,64.58 132.12,65.66 | v112.49,21.08 113.57,22.16 121,22.16 122.72,23.88 122.72,27.62 123.86,28.77 123.86,29.78 121.96,31.69 v120.69,31.69
  Bottom 0.254: LCD1.33 112.81,8.57 112.75,8.64 112.75,10.6 112.88,10.73 112.88,20.7 v112.49,21.08 | v123.61,62.87 123.8,62.67 123.8,41.53 120.81,38.54 120.81,36.45 121.07,36.2 121.07,32.07 v120.69,31.69
3V3TOUCH_IRQ  (via drill 0.6)
  Top 0.254: v110.91,22.92 111.1,22.73 120.75,22.73 122.15,24.13 122.15,28 121.32,28.83 121.32,29.72 118.97,32.07 v118.97,32.51 | IC8.7 131.49,66.37 131.54,66.42 131.54,68.45 130.97,69.03 128.11,69.03 127.86,68.77 120.05,68.77 v119.67,69.15
  Bottom 0.254: v110.91,22.92 109.76,21.78 109.76,9.03 LCD1.34 | v119.67,69.15 119.67,61.02 118.91,60.26 118.91,53.78 117.51,52.39 117.51,46.29 119.29,44.51 119.29,32.83 v118.97,32.51
3V3TOUCH_SCLK  (via drill 0.6)
  Top 0.254: v121.19,26.23 120.56,25.59 117.38,25.59 114.97,28 114.97,31.43 109.32,37.08 109.32,38.67 108.16,39.83 IC7.7
  Bottom 0.254: LCD1.29 122.97,11.56 122.15,12.38 122.15,25.27 v121.19,26.23
!3V3ADC1_SELECT
  Top 0.254: IC9.6 101.95,80.26 103.54,78.68 103.54,76.33 104.99,74.88 IC4.8
!3V3ADC2_SELECT  (1 unrouted)
  Top 0.254: IC13.6 127.54,85.83 127.54,85.79 127.61,85.72 127.61,84.58 126.72,83.69 125.76,83.69 123.67,81.6 116.94,81.6 116.18,82.36 114.27,82.36 113.7,81.79 113.7,77.03 112.62,75.95 109.64,75.95 108.24,74.55 108.24,73.53 108.18,73.47 | IC4.3 108.19,73.48
!3V3BP_OE  (via drill 0.6)
  Top 0.254: IC2.10 126.97,51.56 v126.72,51.31 | v126.4,61.91 119.03,61.91 117.51,63.44 v113.45,63.44
  Top 0.305: IC1.21 78.72,39.64 78.97,39.88 78.97,57.72 v78.58,58.1
  Bottom 0.254: v126.72,51.31 127.23,51.82 127.23,61.09 v126.4,61.91 | v113.45,63.44 98.59,63.44 93.76,58.61 79.09,58.61 v78.58,58.1
!3V3CONVEND1  (via drill 0.6)  (2 unrouted)
  Top 0.254: v109.19,82.61 109.19,85.79 109.25,85.85 | 129.51,65.66 129.51,66.93 129.64,67.06 129.64,67.88 129.07,68.45 128.31,68.45 128.11,68.26 114.02,68.26 113.45,68.83 113.45,74.23 116.24,77.03 116.24,78.68 114.72,80.2 v114.72,81.47
  Bottom 0.254: v114.72,81.47 114.34,81.09 110.72,81.09 v109.19,82.61
!3V3CONVEND2  (via drill 0.6)
  Top 0.254: v134.59,83.63 IC12.6 | v133.64,75.5 134.15,75.5 136.05,73.6 136.05,67.69 v135.67,67.31 | IC8.3 128.88,67.31 v128.69,67.5
  Bottom 0.254: v134.59,83.63 134.02,83.06 134.02,75.88 v133.64,75.5 | v135.67,67.31 135.67,67.25 135.35,66.93 129.26,66.93 v128.69,67.5
!3V3DAC1_SELECT  (1 unrouted)
  Top 0.254: 99.41,85.92 99.41,79.63 101,78.04 101,76.71 101.38,76.33 102.71,76.33 104.33,74.71 IC4.9
!3V3DAC2_SELECT  (1 unrouted)
  Top 0.254: 125.07,85.85 125.13,85.92 | IC13.4 125.07,83.82 123.42,82.17 117.19,82.17 116.43,82.93 114.08,82.93 113.13,81.98 113.13,80.39 111.16,78.42 111.16,77.22 110.46,76.52 109.38,76.52 107.53,74.66 107.53,73.58 IC4.4
!3V3EEPROM_SELECT  (via drill 0.6)
  Top 0.254: IC15.1 v127.8,45.72 | IC2.6 126.51,54.18 v126.27,54.42
  Bottom 0.254: v127.8,45.72 125.76,47.75 125.76,51.69 126.27,52.2 v126.27,54.42
!3V3ETH_IRQ  (via drill 0.6)
  Top 0.254: v156.88,68.83 IC16.4 156.88,67.18 | IC8.6 130.83,67.83 v130.59,68.07
  Bottom 0.254: v156.88,68.83 155.36,68.83 154.85,69.34 134.66,69.34 133.38,68.07 v130.59,68.07
!3V3ETH_SELECT  (via drill 0.6)
  Top 0.254: IC16.9 153.63,65.46 153.32,65.15 153.32,63.5 v153.96,62.87 | IC2.7 125.84,53.52 125.19,54.17 v125.19,55.18
  Bottom 0.254: v153.96,62.87 153.39,62.87 153.13,62.61 138.72,62.61 138.21,62.1 131.35,62.1 130.59,62.87 126.02,62.87 125.13,61.98 125.13,57.47 125.7,56.9 125.7,55.69 v125.19,55.18
!3V3IO_EXPANDER1
  Top 0.254: IC9.3 98.14,84.52 98.59,84.07 98.59,77.03 99.86,75.75 102.46,75.75 103.67,74.55 IC4.10
!3V3IO_EXPANDER2
  Top 0.254: IC13.3 123.8,83.38 123.16,82.74 117.51,82.74 116.75,83.5 113.89,83.5 112.56,82.17 112.56,80.64 110.78,78.87 109.51,78.87 108.62,77.98 108.62,76.58 106.92,74.88 IC4.5
!3V3ISOLATOR1_EN  (via drill 0.6)
  Top 0.254: IC10.13 117.64,72.71 v117.64,70.04 | IC4.7 105.65,71.36 107.6,69.41 v108.62,69.41
  Bottom 0.254: v108.62,69.41 109.06,69.85 117.45,69.85 v117.64,70.04
!3V3ISOLATOR2_EN  (via drill 0.6)
  Top 0.254: IC10.10 119.57,71.48 v119.92,71.12 | v108.11,70.74 107.1,70.74 106.26,71.58 IC4.6
  Bottom 0.254: v119.92,71.12 117.38,71.12 116.69,70.42 108.43,70.42 v108.11,70.74
!3V3RESET  (via drill 0.6)
  Top 0.254: IC16.10 152.97,65.62 152.37,65.02 v152.37,64.9 | IC9.5 v100.68,84.45 | v126.34,84.64 IC13.5 | v130.97,79.06 131.48,78.55 131.48,77.22 132.24,76.45 134.02,76.45 136.62,73.85 136.62,65.72 v135.93,65.02 135.93,63.44 132.18,59.69 132.18,56.01 131.65,55.47 IC2.4
  Bottom 0.254: v100.68,84.45 101.64,83.5 103.67,83.5 106.65,86.49 124.62,86.49 126.34,84.77 v126.34,84.64 126.34,83.69 v130.97,79.06 | v152.37,64.9 152.31,64.9 151.74,64.33 138.15,64.33 137.89,64.58 136.37,64.58 v135.93,65.02
!3V3RTC_IRQ  (via drill 0.6)
  Top 0.254: IC14.5 167.46,60.35 165.9,61.91 v165.26,61.91 | v130.21,64.01 130.21,65.63 IC8.5
  Bottom 0.254: v165.26,61.91 165.26,62.99 164.44,63.82 153.45,63.82 152.82,63.18 138.47,63.18 137.96,62.67 131.54,62.67 v130.21,64.01
!ADC1_SELECT  (via drill 0.6)
  Top 0.254: v104.68,69.47 104.68,67.94 104.33,67.59 IC4.16
  Bottom 0.254: v104.68,69.47 104.68,70.48 109.7,75.5 112.81,75.5 MCU.15
!ADC2_SELECT  (via drill 0.6)
  Top 0.254: IC4.21 107.58,64.49 107.22,64.14 107.22,58.23 105.83,56.83 v105.83,56.07
  Bottom 0.254: v105.83,56.07 105.32,56.07 92.11,42.86 MCU.48
!BP_OUT1  (via drill 0.6)
  Top 0.254: IC1.6 83.99,40.91 84.17,41.08 84.17,45.09 82.46,46.8 82.46,60.13 79.03,63.56 62.27,63.56 62.27,63.63 61.57,64.33 59.98,64.33 v59.66,64.64
  Top 0.305: R1.1 39.21,94.17 40.67,92.71 v40.67,84.14
  Top 0.406: Q1.1 37.62,94.31 R1.1
  Bottom 0.305: v40.67,84.14 46.71,84.14 51.72,79.12 51.72,67.12 54.2,64.64 v59.66,64.64
!BP_OUT2  (via drill 0.6)  (1 unrouted)
  Top 0.305: IC1.7 80.31,41.52 79.54,42.29 79.54,58.55 77.5,60.58 57.63,60.58 50.64,67.56 50.64,81.6 v45.56,86.68
  Bottom 0.305: v45.56,86.68 39.79,86.68 35.98,90.49 25.63,90.49 25.31,90.17
!BP_OUT3  (via drill 0.6)
  Top 0.305: IC1.8 80.54,42.18 80.17,42.55 80.17,59.12 78.08,61.21 57.88,61.21 51.28,67.82 51.28,82.93 v47.15,87.06
  Bottom 0.305: LED_01_POS.2 25.57,91.88 26.01,91.44 36.23,91.44 40.04,87.63 46.58,87.63 v47.15,87.06
!BP_OUT5  (via drill 0.6)
  Top 0.254: IC1.10 81.05,43.45 80.74,43.75 80.74,59.37 78.33,61.78 61.06,61.78 v60.68,62.17
  Bottom 0.254: v60.68,62.17 60.68,81.47 59.28,82.87 58.33,82.87 LED_S1.C
!BP_OUT6  (via drill 0.6)
  Top 0.254: IC1.11 81.65,44.05 81.31,44.39 81.31,59.63 78.52,62.42 61.76,62.42 61.06,63.12 56.8,63.12 51.85,68.07 51.85,83.69 45.69,89.85 v45.69,90.11
  Bottom 0.254: LED_01_NEG.4 45.67,90.12 v45.69,90.11
!BP_OUT7  (via drill 0.6)
  Top 0.254: 82.7,44.72 82.13,44.72 81.89,44.96 81.89,59.88 78.78,62.99 62.01,62.99 61.31,63.69 57.06,63.69 52.42,68.33 52.42,83.95 46.77,89.6 46.77,90.81 v45.69,91.89
  Top 0.305: IC1.12 82.7,44.72
  Bottom 0.254: LED_01_NEG.2 v45.68,91.88 v45.69,91.89
!BP_OUT8  (via drill 0.6)  (1 unrouted)
  Top 0.254: Q4.1 41.75,35.88 v42.07,35.56 | R6.2 | IC1.13 69.9,44.72 68.93,43.75 R3.1 Q3.1 64.87,43.75 v64.87,37.72
  Top 0.305: IC1.13 77.71,44.72 | Q4.1 41.75,40.13 41.69,40.2
  Top 0.406: R3.1
  Bottom 0.254: v42.07,35.56 47.6,35.56 48.11,36.07 63.22,36.07 v64.87,37.72
!BP_OUT9  (via drill 0.6)
  Top 0.254: R4.1 36.67,40.26 v37.56,39.37 | IC1.14 70.44,44.05 68.55,42.16 v68.55,38.61
  Top 0.305: Q2.1 36.53,40.19 R4.1
  Bottom 0.254: v37.56,39.37 39.22,39.37 40.29,38.29 40.29,35.88 41.56,34.61 47.72,34.61 48.36,35.24 65.19,35.24 v68.55,38.61
!BP_OUT10  (via drill 0.6)
  Top 0.254: IC1.15 70.85,43.45 69.5,42.1 v69.5,37.53
  Top 0.305: 77.55,43.43 IC1.15
  Bottom 0.305: LED_O2-.C 24.82,36.13 27.72,36.13 28.23,36.64 35.28,36.64 38.77,33.15 52.68,33.15 53.69,34.16 66.14,34.16 v69.5,37.53
!BP_OUT12  (via drill 0.6)
  Top 0.254: v70.27,36.26 70.58,36.58 70.58,40.39 72.37,42.18 IC1.17
  Bottom 0.254: 58.4,30.1 LED_S2.C
  Bottom 0.305: 58.4,30.1 57.57,30.1 56.68,30.99 56.68,32.7 57.25,33.27 67.28,33.27 v70.27,36.26
!BP_OUT13  (via drill 0.6)  (1 unrouted)
  Top 0.254: IC1.18 73.3,41.52 v71.6,39.81
  Bottom 0.254: 43.09,36.96 47.91,36.96 50.71,39.75 71.54,39.75 v71.6,39.81
!BP_OUT14
  Top 0.254: IC1.19 75.23,40.91 73.06,38.73 73.06,34.99 72.17,34.1 R7.1
  Top 0.305: IC1.19 78.09,40.91
  Top 0.406: Q5.1 68.22,34.11 R7.1
!BP_OUT15  (via drill 0.6)
  Top 0.305: IC1.20 76.28,40.24 v75.92,39.88 | v80.93,99.95 80.93,99.44 76.42,94.93 76.42,86.93 v75.98,86.49
  Bottom 0.305: v80.93,99.95 LED_PWR.C | v75.92,39.88 75.92,86.42 v75.98,86.49
!CH1_ADC
  Top 0.305: IC9.11 101.95,93.92 105.44,97.41 105.44,99.57 X7.6
!CH1_DAC
  Top 0.305: IC9.13 99.41,93.92 102.91,97.41 102.91,99.57 X7.4
!CH1_EXPANDER
  Top 0.305: IC9.14 98.14,94.81 X7.3
!CH1_INT
  Top 0.305: IC11.3 109.19,96.33 107.99,97.54 107.99,99.57 X7.8
!CH1_RESET
  Top 0.305: IC9.12 100.68,94.3 104.18,97.79 X7.5
!CH2_ADC
  Top 0.305: IC13.11 127.61,94.3 130.84,97.54 130.84,99.57 X8.6
!CH2_DAC
  Top 0.305: IC13.13 125.07,94.3 128.31,97.54 128.31,99.57 X8.4
!CH2_EXPANDER
  Top 0.305: IC13.14 123.8,95.06 X8.3
!CH2_INT
  Top 0.305: IC12.3 134.59,96.33 133.38,97.54 133.38,99.57 X8.8
!CH2_RESET
  Top 0.305: IC13.12 126.34,94.74 129.57,97.98 X8.5
!CONVEND1  (via drill 0.6)
  Top 0.254: v116.11,81.09 116.11,80.26 117.45,78.93 118.72,78.93 121.7,75.95 125.89,75.95 127.03,74.8 129.64,74.8 130.2,74.24 IC8.20
  Bottom 0.254: v116.11,81.09 115.54,80.52 108.68,80.52 107.54,79.38 102.02,79.38 100.3,77.66 MCU.21
!CONVEND2  (via drill 0.6)
  Top 0.254: v118.59,76.45 120.37,76.45 121.45,75.37 125.64,75.37 126.78,74.23 129.19,74.23 129.54,73.89 IC8.21
  Bottom 0.254: v118.59,76.45 118.78,76.64 118.78,78.11 118.08,78.8 109.45,78.8 108.62,77.98 108.62,77.28 107.79,76.45 104.11,76.45 102.91,77.66 MCU.20
!DAC1_SELECT  (via drill 0.6)
  Top 0.254: IC4.15 103.67,68.39 v103.73,68.45
  Bottom 0.254: v103.73,68.45 103.73,70.48 109.32,76.07 110.84,76.07 MCU.16
!DAC2_SELECT  (via drill 0.6)  (1 unrouted)
  Top 0.254: v105.57,57.91 106.65,58.93 106.65,64.39 106.92,64.66 IC4.20
  Bottom 0.254: MCU.47 90.84,45.91 93.57,45.91 v105.57,57.91
!EEPROM_SELECT  (via drill 0.6)  (2 unrouted)
  Top 0.254: 89.57,42.16 90.78,43.37 94.08,43.37 | IC2.18 134.64,53.52 134.4,53.28 134.4,51.69 130.59,47.88 124.56,47.88 122.72,49.72 104.75,49.72 v104.3,50.16
  Bottom 0.254: v104.3,50.16 100.24,50.16 94.02,43.94 v94.02,43.43
!ETH_IRQ  (via drill 0.6)
  Top 0.254: v118.97,80.64 120.81,78.8 125.64,78.8 126.4,78.04 126.4,77.09 127.54,75.95 130.21,75.95 131.49,74.66 IC8.18
  Bottom 0.254: v118.97,80.64 117.7,79.38 109.19,79.38 107.48,77.66 MCU.18
!ETH_SELECT  (via drill 0.6)
  Top 0.254: IC2.17 137.82,52.88 138.53,53.59 138.47,73.34 138.47,73.66 136.69,75.44 v136.69,78.74
  Bottom 0.254: MCU.11 151.16,77.66 150.02,78.8 146.85,78.8 146.28,79.38 139.67,79.38 139.48,79.57 137.51,79.57 v136.69,78.74
!IO_EXPANDER1  (via drill 0.6)
  Top 0.254: v102.71,69.47 102.71,68.14 103.03,67.82 IC4.14
  Bottom 0.254: v102.71,69.47 102.71,70.23 109.89,77.41 MCU.17
!IO_EXPANDER2  (via drill 0.6)
  Top 0.254: IC4.19 106.28,64.78 106.08,64.58 106.08,60.45 v105.7,60.07
  Bottom 0.254: v105.7,60.07 106.72,59.05 106.72,57.72 105.95,56.96 105.38,56.96 93.06,44.64 MCU.46
!ISOLATOR1_EN  (via drill 0.6)  (1 unrouted)
  Top 0.254: v105.7,68.26 105.7,68.14 104.99,67.42 IC4.17
  Bottom 0.254: 117.45,77.66 116.62,77.66 113.89,74.93 109.95,74.93 105.7,70.67 v105.7,68.26
!ISOLATOR2_EN  (via drill 0.6)  (1 unrouted)
  Top 0.254: IC4.18 105.62,64.95 105.51,64.83 105.51,62.74 v104.62,61.85
  Bottom 0.254: MCU.45 90.84,48.45 90.84,50.1 91.73,50.99 97.89,50.99 104.11,57.21 104.11,61.34 v104.62,61.85
!PWD_RST
  Bottom 0.254: JP1.1 MCU.A13
!RESET  (via drill 0.6)
  Top 0.254: IC2.20 136.93,54.81 137.39,54.36 v137.39,53.85
  Bottom 0.254: X5.2 170.79,13.78 170.28,14.29 160.88,14.29 158.75,16.42 SW1.3 SW1.4 156.21,26.2 153.07,29.34 MCU.RESET 153.07,38.16 v137.39,53.85
!RTC_IRQ  (via drill 0.6)
  Top 0.254: v117.51,80.64 118.65,79.5 118.97,79.5 121.96,76.52 126.15,76.52 127.29,75.37 129.96,75.37 130.83,74.5 IC8.19
  Bottom 0.254: MCU.19 105.95,78.8 107.79,78.8 108.94,79.95 116.81,79.95 v117.51,80.64
+3V3  (via drill 0.6, 0.7)  (5 unrouted)
  Top 0.254: IC15.3 130.84,43.18 131.16,42.86 v131.16,40.77 | IC16.25 156.88,60.2 | C39.1 160.75,60.01 | IC16.15 150.38,60.1 | 158.82,60.01 159.04,60.01
  Top 0.305: IC15.7 IC15.8 | 129.07,58.9 C11.1 | IC16.15 150.38,58.64 150.59,58.42 152.94,58.42 | 152.94,58.42 153.39,58.42 153.63,58.66 IC16.20 153.63,61.14 153.83,61.34 156.63,61.34 156.88,61.09 156.88,60.2 | 156.88,60.01 IC16.25 156.88,58.61 157.07,58.42 158.59,58.42 158.78,58.61 158.78,59.97 IC16.28 158.82,60.01 | IC16.19 152.97,58.45 152.94,58.42 | IC9.1 95.6,86.42 94.84,87.19 94.17,87.19 C25.1 | 113.51,87.57 112.3,87.57 111.73,87 IC11.8 | IC12.8 137.13,86.86 137.45,87.19 138.38,87.19 C30.1 | C32.1 120.85,87.59 121.26,87.19 IC13.1 | 134.55,45.82 135.35,45.72 135.35,47.37 135.8,47.37 | C27.2 116.91,73.05 116.94,73.03 116.94,72.77 | C13.1 111.06,55.41 110.11,56.36 IC3.1 | 106.93,35.92 IC7.1 106.89,35.88 107.6,35.88 108.11,35.37 108.11,34.23 | v109.13,34.29 108.11,34.27 C20.1 | IC5.1 118.65,35.29 118.65,35.88 116.75,35.88 C17.1 | IC2.1 128.94,57.43 128.94,58.93 C11.1 | C11.1 129.13,58.93 | IC8.1 127.2,65.65 C22.1 | 111.49,73.03 109.51,73.03 109.51,73.47
  Top 0.356: IC1.24 77.95,37.7 77.44,37.72 77.57,37.59
  Top 0.406: C24.1 151.1,15.62 151.42,15.68 | R15.2 132.49,1.65 132.43,1.59 | R22.2 96.99,13.39 Q9.2 87.02,13.39 v86.58,12.95 | 134.55,45.82 IC15.8 | C36.1 135.8,47.37 137.19,47.37 137.26,47.31 | 126.08,67.09 C22.1 126.59,67.06 v126.84,67.31 | v95.79,88.01 94.18,88.01 C25.1 | v114.53,88.01 113.95,88.01 113.51,87.57 | v118.4,88.01 119,88.01 C32.1 | v137.45,88.01 138.34,88.01 138.78,87.57 C30.1 | D7.A v165.45,50.48 | 160.75,60.01 162.21,60.01 162.85,59.37 v162.85,53.28 | 159.04,60.01 160.54,60.01 C39.1 | C27.2 114.42,73.05 v114.4,73.03 | v112.49,73.03 111.49,73.03 C15.1 | C17.1 116.75,40.07 | C11.1 129.09,59.14 v130.27,60.13 130.21,60.2 119.86,60.2 114.53,54.86 C13.1 | v145.83,91.5 L1.P$2
  Top 0.508: 77.57,37.59 77.57,35.81 77.82,35.56 | JP4.3 139.1,18.1
  Top 0.61: C6.1 78.2,35.56 | 78.2,35.56 | 78.2,35.56 C6.1 | v86.58,31.43 81.19,31.43 80.55,32.07 80.55,34.04 79.03,35.56 78.2,35.56 | v126.15,40.07 116.75,40.07 111.79,40.07 v111.35,40.51
  Top 0.813: v86.58,12.95 86.58,5.84 90.84,1.59 132.43,1.59 147.67,1.59 | v140.56,87.88 141.26,87.88 141.83,87.31 141.83,72.64
  Top 1.016: 139.1,24.26 137.26,26.1 v137.26,40.83 137.26,47.31 v141.83,51.88 v141.83,55.05 v141.83,60.39 141.83,72.64 v141.83,72.77 141.83,72.9
  Top 1.27: 151.42,15.68 151.42,11.49 151.36,11.43 | 146.09,12.19 146.02,12.26 140.81,12.26 139.1,13.97 139.1,18.1 JP2.1 139.1,24.26
  Bottom 0.406: v118.4,88.01 118.21,88.01 | v165.45,50.48 143.16,50.48 141.83,51.82 v141.83,51.88 | 125.89,72.77 126.08,72.58 126.08,68.07 v126.84,67.31 | v109.13,34.29 109.13,38.29 v111.35,40.51
  Bottom 0.508: v140.56,87.88 140.43,88.01 141.45,88.01 144.94,91.5 v145.83,91.5
  Bottom 0.61: v86.58,31.43 v86.58,12.95 | v162.85,53.28 152.05,53.28 150.28,55.05 v141.83,55.05 | 125.89,72.77 125.7,72.71 125.45,72.96 114.46,72.96 v114.4,73.03 v112.49,73.03 | v141.83,60.39 130.53,60.39 v130.27,60.13 | v137.26,40.83 137.13,40.83 137.07,40.77 v131.16,40.77 128.05,40.77 127.35,40.07 v126.15,40.07
  Bottom 0.813: v95.79,88.01 v114.53,88.01 118.21,88.01 | v118.4,88.01 v137.45,88.01 140.18,88.01 v140.56,87.88 | v141.83,72.77 125.89,72.77
  other vias: 161.13,5.65 161.13,7.11 161.13,8.57 161.13,10.03 152.75,5.65 152.75,7.11 152.75,8.57 152.75,10.03 152.75,11.49 161.13,11.49
  pour Top (isolate 0.406, no thermals): 175.29,14.29 145.77,14.29 145.77,-0.32 175.29,-0.32
  pour Bottom (isolate 0.406, no thermals): 175.29,14.29 145.77,14.29 145.77,-0.32 175.29,-0.32
+5V  (via drill 0.6)  (4 unrouted)
  Top 0.305: 159.49,18.55 159.48,18.55 | Q2.2 34.66,40.21 R4.2 | 67.58,45.64 Q3.2 | 77.06,85.09 77.06,94.74 81.95,99.63 v81.95,102.04
  Top 0.406: C19.1 159.36,18.55 | 67.58,45.64 R3.2 | D2.C 20.93,34.62 20.93,37.72 v24.04,40.83 | R4.2 v33.82,40.26 | v66.08,41.02 66.08,36.01 Q5.2 66.1,36 R7.2 | Q3.2 66.06,45.64 v66.08,45.66 | v41.69,93.85 v41.69,96.08 40.1,96.07 R1.2 37.64,96.19 Q1.2 | L2.P$1 v79.98,80.58
  Top 0.61: 143.61,18.48 143.66,18.43 JP4.1 143.66,23.35 JP2.3 | C3.1 v49.12,40.32 | MCU.5V 147.74,29.4 144.5,32.64 144.5,74.3 142.85,75.95 142.85,89.98 143.61,90.74 143.86,90.49 143.86,86.23 144.62,85.47 SG1.+B | v77.06,84.84 v59.34,84.84
  Top 1.27: 159.48,18.55 159.36,18.55 154.78,18.55 154.66,18.43 | IC6.3 154.66,18.43 | X6.1 166.34,16.89 164.63,18.61 | 164.63,18.61 D6.C | 159.49,18.55 164.57,18.55 164.63,18.61 | MCU.5V 147.99,23.94 148.05,23.88 | JP2.3 148.05,23.88 | 148.05,23.88 149.21,23.88 154.66,18.43
  Bottom 0.305: LED_CV2.A 81.44,32.05 81.33,29.51 81.31,32.07 | LED_CC2.A 81.46,22.05 81.44,22.04 | LED_PWR.A v81.95,102.04 | v77.06,84.84 82.79,84.84 LED_CV1.A
  Bottom 0.406: LED_O2-.A 24,40.8 23.97,40.83 | LED_O2+.A 43.05,40.98 43.09,41.02 | v33.82,40.26 33.82,41.02 | v66.08,45.66 66.08,41.08 66.01,41.02 | LED_01_NEG.3 LED_01_NEG.1 v41.7,93.84 v41.69,93.85 | 83.03,102.04 LED_PWR.A | LED_CC1.A 77.18,75.05 77.06,74.93 | 82.98,85.03 LED_CV1.A | v79.98,80.58 77.19,80.58 77.06,80.71 | LED_S2.A 59.87,32.05 62.46,29.46 73.48,29.46 73.52,29.51
  Bottom 0.61: 49.06,41.02 43.09,41.02 33.82,41.02 24.23,41.02 v24.04,40.83 | v49.12,40.32 49.12,40.96 49.06,41.02 | 49.06,41.02 66.01,41.02 v66.08,41.02 72.23,41.02 73.5,39.75 73.5,29.53 73.52,29.51 81.33,29.51 | LED_01_POS.3 LED_01_POS.1 22.65,92.57 22.64,92.58 26.13,96.07 40.17,96.07 v41.69,96.08 | v41.7,93.84 46.21,93.84 47.91,92.14 47.91,90.55 53.42,85.05 LED_S1.A 58.27,85.03 v59.34,84.84
  Bottom 0.813: JP2.3 144.18,15.62 145.77,14.03 145.77,3.75 144.31,2.29 90.59,2.29 81.44,11.43 81.44,22.04 81.44,32.05 81.44,53.09 77.06,57.47 77.06,74.93 77.06,80.71 v77.06,84.84
+5V_CH1  (via drill 0.6)
  Top 0.305: 66.01,93.6 66.01,95.44 66.27,95.69 67.14,95.69 IC17.4 | 66.39,91.69 66.46,91.63 IC18.8 65.95,91.63 66.01,91.69 66.01,93.6 | 66.01,93.6 C45.1 64.83,92.69 v64.93,92.58 | IC17.1 69.05,93.71 v68.74,93.41 | IC18.4 61.71,86.75 61.63,86.68
  Top 0.406: v64.3,86.68 61.63,86.68 56.3,86.68 54.01,88.96 X11.1
  Bottom 0.305: v68.74,93.41 65.76,93.41 v64.93,92.58
  Bottom 0.406: v64.3,86.68 64.3,91.95 v64.93,92.58
+5V_CH2  (via drill 0.6)
  Top 0.254: v70.46,11.62 70.46,12.22 IC19.1 | IC20.4 54.64,6.92 X12.1
  Top 0.305: IC20.8 67.03,10.74 v67.03,12 67.03,13.21 67.34,13.53 68.54,13.53 IC19.4
  Top 0.406: C47.1 66.27,12.76 v67.03,12
  Bottom 0.406: X12.1 62.58,7.56 v67.03,12 67.41,11.62 v70.46,11.62
BATT_NTC1  (via drill 0.6)
  Top 0.254: MCU.A4 125.13,29.21 123.29,27.37 123.29,23.62 121.26,21.59 114.34,21.59 109.7,16.95 107.6,16.95 106.27,15.62 96.36,15.62 95.41,14.67 76.87,14.67 75.09,16.45 v75.09,38.35 | v79.03,90.87 OK1.4 | v74.97,67.88 R29.2
  Bottom 0.254: v75.09,38.35 74.97,38.48 v74.97,67.88 74.97,89.98 75.85,90.87 v79.03,90.87
BATT_NTC2
  Top 0.254: MCU.A3 127.67,27.18 121.51,21.02 114.59,21.02 109.95,16.38 107.86,16.38 106.52,15.05 96.62,15.05 95.67,14.1 85,14.1 82.9,12 R37.2 82.58,11.81 OK2.4
BP_OE  (via drill 0.6)
  Top 0.254: IC2.14 138.27,50.93 140.24,52.9 140.24,74.99 v140.05,75.18
  Bottom 0.254: MCU.10 148.88,77.66 147.55,76.33 141.83,76.33 140.69,75.18 v140.05,75.18
BP_SELECT  (via drill 0.6)
  Top 0.254: IC2.15 138.15,51.56 139.67,53.09 139.67,74.17 139.1,74.74 v139.1,78.61
  Bottom 0.254: MCU.9 146.97,77.85 146.02,78.8 139.29,78.8 v139.1,78.61
BUZZER  (1 unrouted)
  Top 0.254: Q8.1 157.64,74.99 R13.2 | R13.2 154.72,77.66 MCU.12
CH1_5VDC  (via drill 0.6)
  Top 0.406: C26.1 95.3,90.97 IC9.16 95.6,98.17 98.08,100.65 98.9,100.65 X7.2 | C29.1 111.73,90.97 IC11.1 v111.73,93.21 v111.73,93.22
  Bottom 0.406: v111.73,93.22 101.13,93.22 97.13,97.22 97.13,99.69 98.27,100.84 X7.2
CH1_GND
  pour Top (isolate 0.305): 114.97,102.23 114.97,89.85 93.06,89.85 93.06,102.23
  pour Bottom (isolate 0.305): 114.97,102.23 114.97,89.85 93.06,89.85 93.06,102.23
CH1_MISO
  Top 0.305: IC11.2 110.46,97.1 X7.9
CH1_MOSI
  Top 0.305: IC9.15 96.87,96.08 X7.1
CH1_SCLK
  Top 0.305: IC9.10 103.22,94.23 106.72,97.73 X7.7
CH2_5VDC  (via drill 0.6)
  Top 0.406: C33.1 121.26,90.97 IC13.16 121.26,98.49 123.61,100.84 X8.2 | C31.1 137.13,90.97 IC12.1 v137.13,93.21 v137.13,93.22
  Bottom 0.406: v137.13,93.22 126.27,93.22 122.72,96.77 122.72,99.95 123.61,100.84 X8.2
CH2_GND
  pour Top: 118.46,102.23 140.37,102.23 140.37,89.85 118.46,89.85
  pour Bottom: 118.46,102.23 140.37,102.23 140.37,89.85 118.46,89.85
CH2_MISO
  Top 0.305: IC12.2 135.86,97.1 X8.9
CH2_MOSI
  Top 0.305: IC13.15 122.53,96.33 X8.1
CH2_SCLK
  Top 0.305: IC13.10 128.88,94.74 132.12,97.98 X8.7
EARTH  (via drill 0.6)  (1 unrouted)
  Top 0.305: C41.2 150.08,102.11 v150.02,102.17 | v160.18,84.01 C40.2
  Top 0.406: X4.6.1 54.2,20.32 54.2,19.75 55.09,18.86 60.36,18.86 X4.3.1 | C1.2 43.08,96.47 41.37,98.17 v23.97,98.17 C5.1
  Top 0.813: C7.2 46.58,12.7 X4.6.1
  Top 1.016: C7.2 C10.1 9.3,12.7 J4.P$1 1.37,20.63 1.37,76.77 22.77,98.17 v23.97,98.17
  Bottom 0.305: v150.02,102.17 150.02,103.69 | X10.4 158.53,91.95 159.8,93.22 X10.5 | X10.SH1 161,84.83 v160.18,84.01
  Bottom 0.406: 151.36,103.63 151.42,103.69 | X4.3.1 61.88,25.4 | X4.6 X4.6.1
  Bottom 0.61: X10.SH1 163.8,93.22 | 163.8,93.22 X10.SH2 | X10.5 163.8,93.22
  Bottom 0.813: X10.SH2 160.44,103.69 151.42,103.69 150.02,103.69 29.5,103.69 v23.97,98.17
ETH_IN+  (via drill 0.6)  (1 unrouted)
  Top 0.254: R19.1 154.46,99.76 | 151.04,67.28 151.04,69.72 151.48,70.17 151.48,76.33 150.78,77.03 150.78,78.04 152.75,80.01 v152.75,83.88
  Top 0.305: 151.04,67.28 IC16.13 | R19.1 | X10.8 156.12,97.03 155.48,97.66 155.48,99.31 155.04,99.76 154.09,99.76
  Bottom 0.254: X10.8 157.32,96.39 155.8,96.39 153.64,94.23 153.64,84.77 v152.75,83.88
ETH_IN-  (via drill 0.6)